# EAGLE schematic PCB BOTTOM (EAGLE 9.5.0)
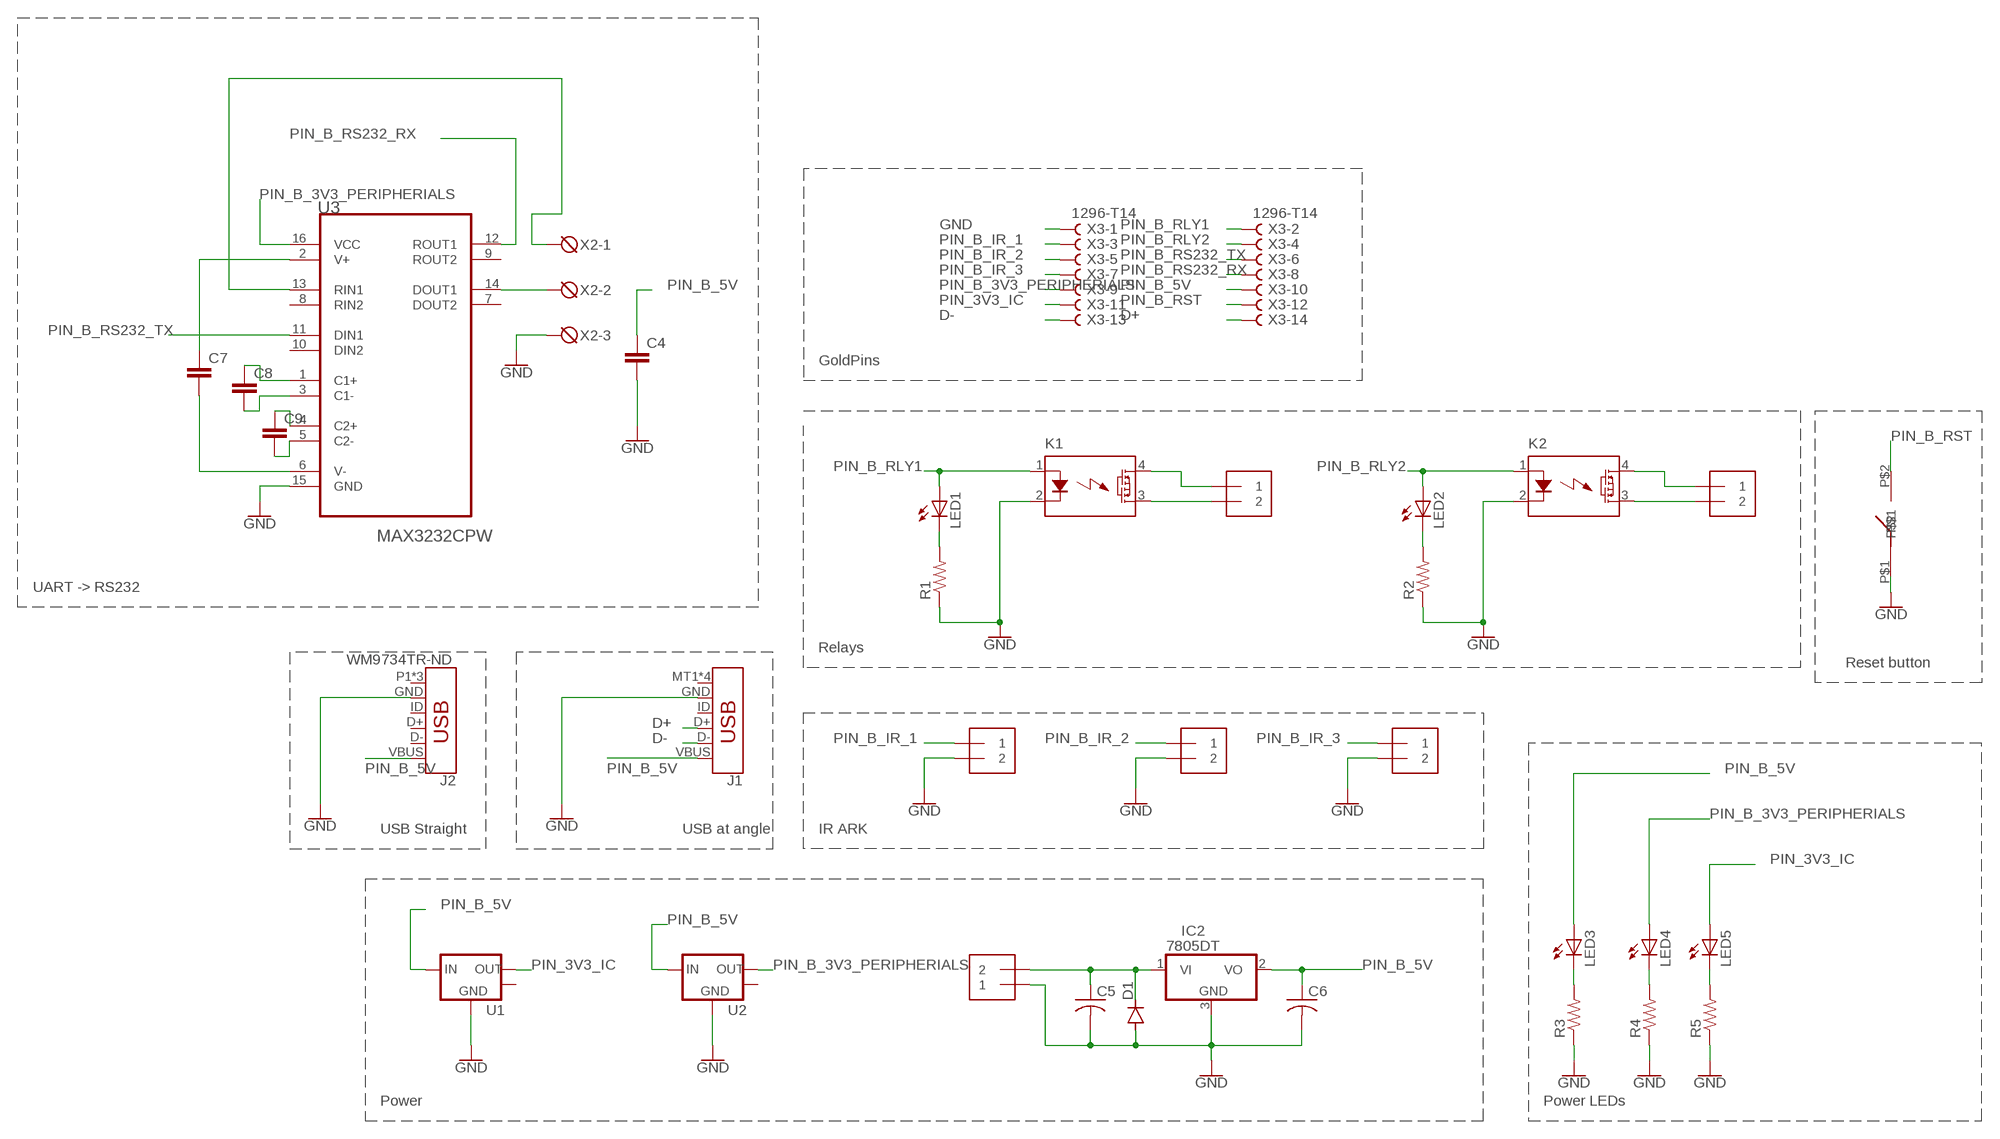
[diagram p0: schematic, sheet 1]

## Parts
C4  C-EUC0805K  [C0805K]
C5  C-USC1206K  [C1206K]
C6  C-USC1206K  [C1206K]
C7  C-EUC0805K  [C0805K]
C8  C-EUC0805K  [C0805K]
C9  C-EUC0805K  [C0805K]
D1  DIODE-SOD80C  [SOD80C]
IC2  7805DT  [TO252]
IR1  1X2-3.5MM  [1X2-3.5MM]
IR2  1X2-3.5MM  [1X2-3.5MM]
IR3  1X2-3.5MM  [1X2-3.5MM]
J1  USB_MICRO-B_SMT  [USB-MICROB]
J2  WM9734TR-ND  USB_MICRO-B_FEMALE-SMT-VERT  [USB-B-MICRO-SMD_VERT]
K1  CPC1008N  [SOIC-4-2.54]
K2  CPC1008N  [SOIC-4-2.54]
LED1  LEDCHIP-LED0805  [CHIP-LED0805]
LED2  LEDCHIP-LED0805  [CHIP-LED0805]
LED3  LEDCHIP-LED0805  [CHIP-LED0805]
LED4  LEDCHIP-LED0805  [CHIP-LED0805]
LED5  LEDCHIP-LED0805  [CHIP-LED0805]
PWR  1X2-3.5MM  [1X2-3.5MM]
R1  R-US_M0805  [M0805]
R2  R-US_M0805  [M0805]
R3  R-US_M0805  [M0805]
R4  R-US_M0805  [M0805]
R5  R-US_M0805  [M0805]
RLY1  1X2-3.5MM  [1X2-3.5MM]
RLY2  1X2-3.5MM  [1X2-3.5MM]
U1  LM1117-1.8  [SOT223]
U2  LM1117-1.8  [SOT223]
U3  MAX3232CPW  [SOP65P640X120-16N]
U$1  MICRO_SWITCH_AT_ANGLE  [MICRO_SWITCH_AT_ANGLE]
X2  DG3XX-03-3.5  [DG350-3.5-03P]
X3  1296-T14  [1296-14]

## Nets
D+: J1.D+ X3.14
D-: J1.D- X3.13
GND: C4.2 C5.2 C6.2 D1.A IC2.3(GND) IR1.2 IR2.2 IR3.2 J1.GND J2.GND K1.2(K) K2.2(K) PWR.1 R1.1 R2.1 R3.1 R4.1 R5.1 U1.1(GND) U2.1(GND) U3.15(GND) U$1.P$1 X2.3 X3.1
N$1: K1.3(D2) RLY1.2
N$2: K1.4(D1) RLY1.1
N$3: LED1.C R1.2
N$4: K2.3(D2) RLY2.2
N$5: K2.4(D1) RLY2.1
N$6: LED2.C R2.2
N$7: U3.14(DOUT1) X2.2
N$8: U3.13(RIN1) X2.1
N$13: LED3.C R3.2
N$14: LED4.C R4.2
N$15: LED5.C R5.2
N$16: C7.1 U3.2(V+)
N$17: C7.2 U3.6(V-)
N$18: C9.1 U3.4(C2+)
N$19: C9.2 U3.5(C2-)
N$20: C8.2 U3.3(C1-)
N$23: C5.1 D1.C IC2.1(VI) PWR.2
N$24: C8.1 U3.1(C1+)
PIN_3V3_IC: LED5.A U1.2(OUT) X3.11
PIN_B_3V3_PERIPHERIALS: LED4.A U2.2(OUT) U3.16(VCC) X3.9
PIN_B_5V: C4.1 C6.1 IC2.2(VO) J1.VBUS J2.VBUS LED3.A U1.3(IN) U2.3(IN) X3.10
PIN_B_IR_1: IR1.1 X3.3
PIN_B_IR_2: IR2.1 X3.5
PIN_B_IR_3: IR3.1 X3.7
PIN_B_RLY1: K1.1(A) LED1.A X3.2
PIN_B_RLY2: K2.1(A) LED2.A X3.4
PIN_B_RS232_RX: U3.12(ROUT1) X3.8
PIN_B_RS232_TX: U3.11(DIN1) X3.6
PIN_B_RST: U$1.P$2 X3.12
Unconnected: J1.ID J1.MT1(SHIELD) J1.MT2(SHIELD) J1.P$1(SHIELD) J1.P$2(SHIELD) J2.D+ J2.D- J2.ID J2.P1(SHIELD) J2.P2(SHIELD) J2.P3(SHIELD) U1.4(MASS) U2.4(MASS) U3.7(DOUT2) U3.8(RIN2) U3.9(ROUT2) U3.10(DIN2)

## Notes on the sheet
- GoldPins
- UART -> RS232
- Relays
- Reset button
- USB Straight | USB at angle | IR ARK
- Power | Power LEDs

## Library data of the parts
C4 C7-C9 = rcl:C-EU: CAPACITOR, European symbol; SPICEPREFIX: C
C5 C6 = adafruit:C-US: CAPACITOR, American symbol
D1 = diode:DIODE-: DIODE
IC2 = linear:78*: Positive VOLTAGE REGULATOR Source: http://cache.national.com/ds/LM/LM78L05.pdf http://www.fairchildsemi.com/ds/LM/LM7805.pdf
IR1-IR3 PWR RLY1 RLY2 = adafruit:1X2: 3.5mm Terminal block http://www.ladyada.net/library/pcb/eaglelibrary.html
J1 = SparkFun-Connectors:USB_MICRO-B: USB Type Micro-B Connector Male/female and PTH/SMT variants SparkFun Products: SparkFun microB USB Breakout <https://www.sparkfun.com/products/12035> SparkFun USB microB Plug Breakout <https://www.sparkfun.com/products/10031> SparkFun ESP8266 Thing <https://www.sparkfun.com/products/13231>; PROD_ID: CONN-09505; SF_ID: PRT-08533
J2 = SparkFun-Connectors:USB_MICRO-B: USB Type Micro-B Connector Male/female and PTH/SMT variants SparkFun Products: SparkFun microB USB Breakout <https://www.sparkfun.com/products/12035> SparkFun USB microB Plug Breakout <https://www.sparkfun.com/products/10031> SparkFun ESP8266 Thing <https://www.sparkfun.com/products/13231>; PROD_ID: CONN-13534
K1 K2 = optocoupler:CPC10: CPC1008N is a miniature low voltage, low on resistance 1-Form-A solid state relay in a 4 pin SOP package. The relay uses optically coupled MOSFET technology to pro- vide 1500V of input to output isolation. CPC1008N CPC1016N CPC1017N CPC1035 Load Voltage (V) 100 100 60 350 Load Current (mA) 150 100 100 100 Max RON (?) 8 16 16 35 Input Control Current: 2~50 mA Input Voltage Drop: 1.2 V (0.9~1.4V)
LED1-LED5 = adafruit:LED: LED OSRAM: - CHIPLED LG R971, LG N971, LY N971, LG Q971, LY Q971, LO R971, LY R971 LH N974, LH R974 LS Q976, LO Q976, LY Q976 LO Q996 - Hyper CHIPLED LW Q18S LB Q993, LB Q99A, LB R99A - SideLED LS A670, LO A670, LY A670, LG A670, LP A670 LB A673, LV A673, LT A673, LW A673 LH A674 LY A675 LS A676, LA A676, LO A676, LY A676, LW A676 LS A679, LY A679, LG A679 - Hyper Micro SIDELED® LS Y876, LA Y876, LO Y876, LY Y876 LT Y87S - SmartLED LW L88C, LW L88S LB L89C, LB L89S, LG L890 LS L89K, LO L89K, LY L89K LS L896, LA L896, LO L896, LY L896 - TOPLED LS T670, LO T670, LY T670, LG T670, LP T670 LSG T670, LSP T670, LSY T670, LOP T670, LYG T670 LG T671, LOG T671, LSG T671 LB T673, LV T673, LT T673, LW T673 LH T674 LS T676, LA T676, LO T676, LY T676, LB T676, LH T676, LSB T676, LW T676 LB T67C, LV T67C, LT T67C, LS T67K, LO T67K, LY T67K, LW E67C LS E67B, LA E67B, LO E67B, LY E67B, LB E67C, LV E67C, LT E67C LW T67C LS T679, LY T679, LG T679 LS T770, LO T770, LY T770, LG T770, LP T770 LB T773, LV T773, LT T773, LW T773 LH T774 LS E675, LA E675, LY E675, LS T675 LS T776, LA T776, LO T776, LY T776, LB T776 LHGB T686 LT T68C, LB T68C - Hyper Mini TOPLED® LB M676 - Mini TOPLED Santana® LG M470 LS M47K, LO M47K, LY M47K Source: http://www.osram.convergy.de/
R1-R5 = adafruit:R-US_: RESISTOR, American symbol
U1 U2 = vreg-linear:LM1117: Linear regulators
U3 = Texas Instruments_By_element14_Batch_1:MAX3232CPW: RS-232 Line Driver/Receiver; MPN: MAX3232CPW; OC_FARNELL: 9853111; OC_NEWARK: 34K7925; PACKAGE: TSSOP-16; SUPPLIER: Texas Instruments
U$1 = !MOJE_WLASNE_SYMBOLE:MICRO_SWITCH_AT_ANGLE: FKHAWKUHFBVWAKJHFBASKJRHFBB FK KUH RVBKJR UAERKIHERGA
X2 = degson:DG3XX-03: DG350-3.5-03P DG306-5.0-03P
X3 = con-leotronics:1296-T14: 1.27mm SINGLE ROW FEMALE SOCKET Source: http://www.leotronics.co.uk/Conexcon/Data%20Sheets/sec.%20A/1296ing.pdf; OC_FARNELL: unknown; OC_NEWARK: unknown